# EAGLE design Starter Shield v1.1 (EAGLE 6.4)
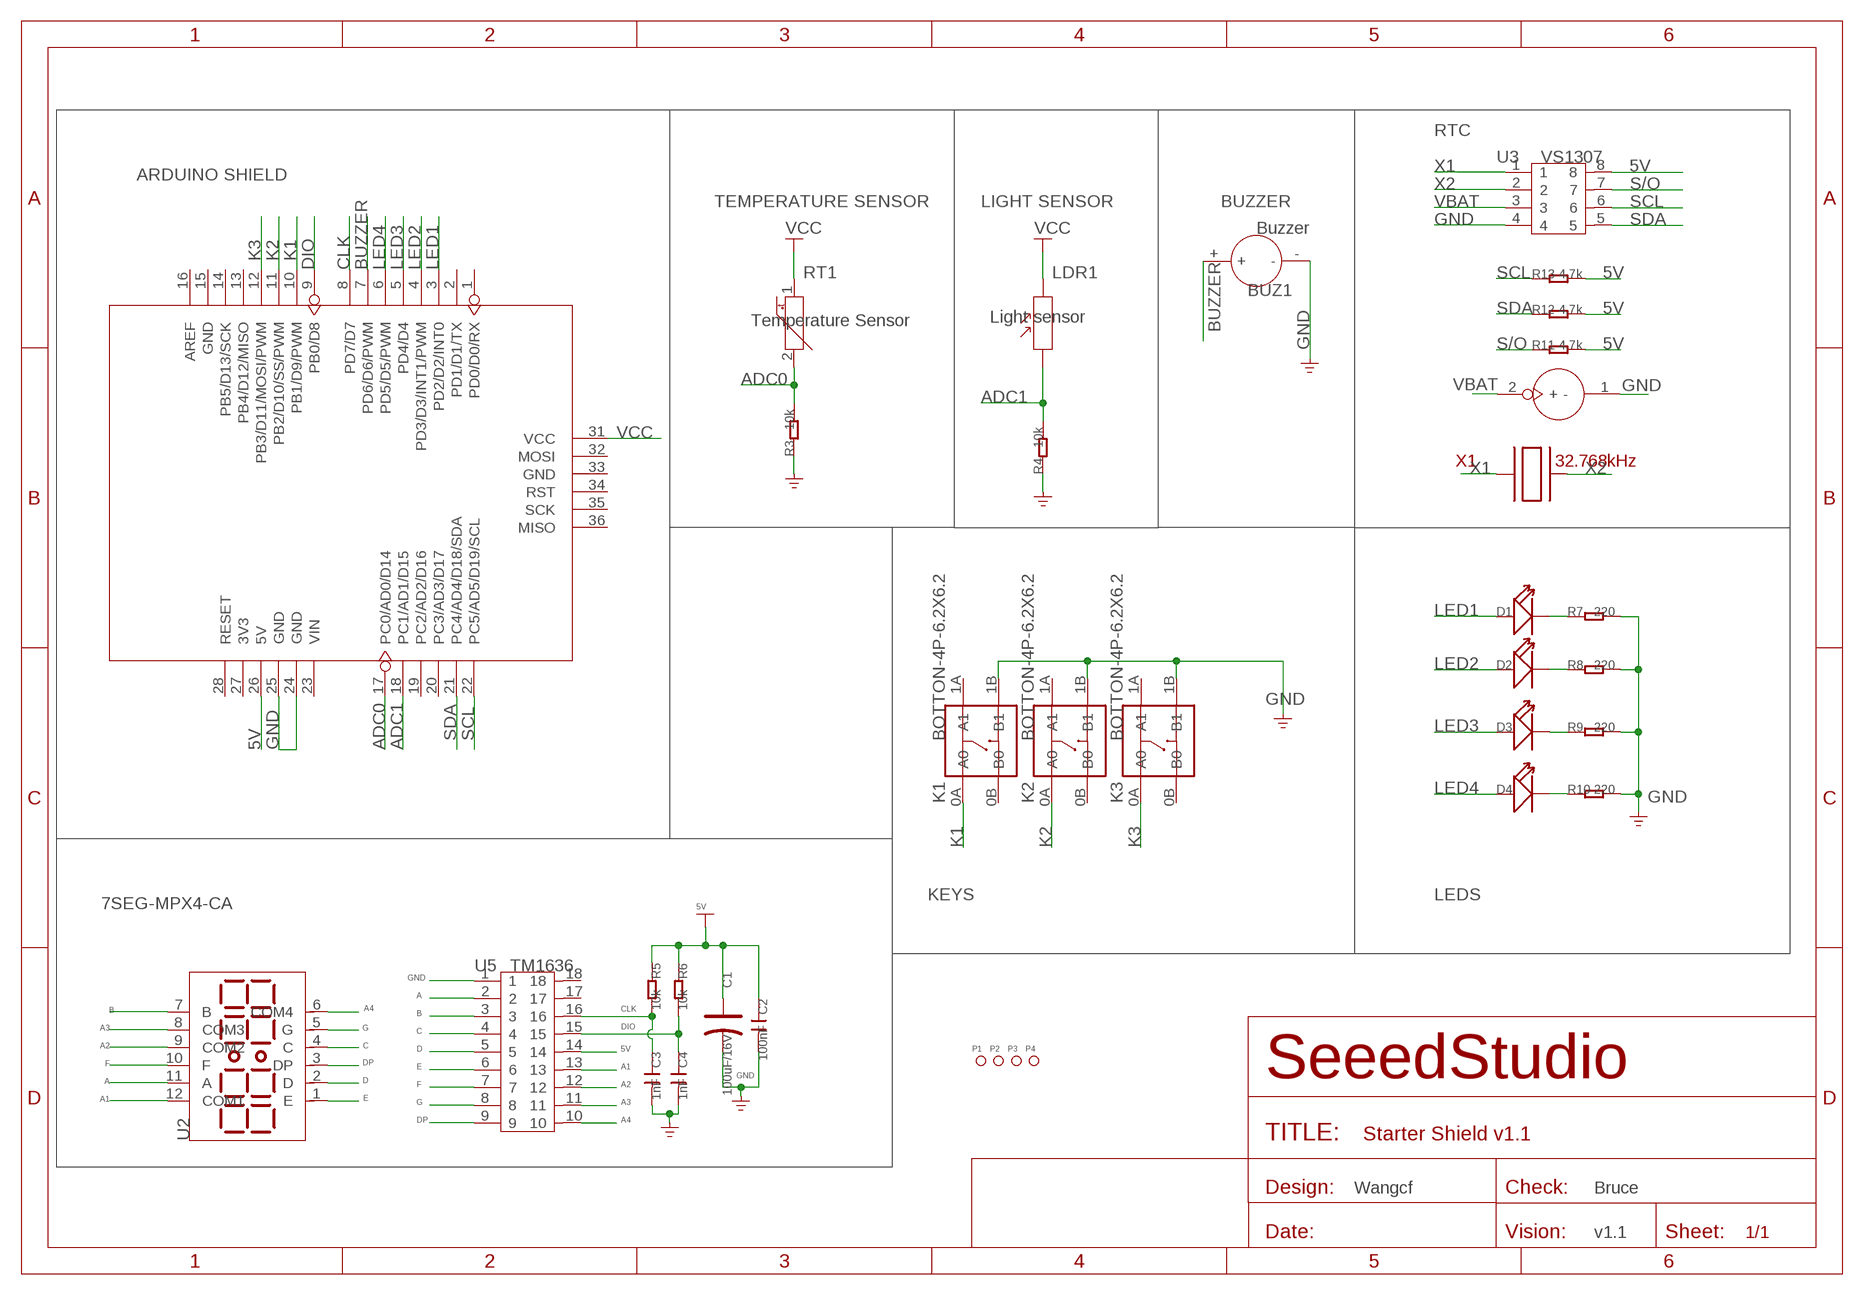
[diagram p0: schematic, sheet 1]

## Parts
BATT1  BATTERYBATTERY1225_SMT  [BATTERY1225_SMT]
BUZ1  Buzzer  BUZZER-YMD12065  [2P-7.6-D12X6.5H]
C1  100uF/16V  CAP-D5.3/2.0  [ELECTRO-5.3MM]
C2  100nF  C'2.54'  [CERAMIC-2.54]
C3  1nF  C'2.54'  [CERAMIC-2.54]
C4  1nF  C'2.54'  [CERAMIC-2.54]
D1  LED-3MM  [LED-2P-2.54-3MM]
D2  LED-3MM  [LED-2P-2.54-3MM]
D3  LED-3MM  [LED-2P-2.54-3MM]
D4  LED-3MM  [LED-2P-2.54-3MM]
K1  BOTTON-4P-6.2X6.2  BOTTON-4P-8X8  [4P-8X8]
K2  BOTTON-4P-6.2X6.2  BOTTON-4P-8X8  [4P-8X8]
K3  BOTTON-4P-6.2X6.2  BOTTON-4P-8X8  [4P-8X8]
LDR1  Light sensor  R-PHOTOVARISTOR  [5528]
P1  PAD-MARK  [ROUND-MARK-1.0]
P2  PAD-MARK  [ROUND-MARK-1.0]
P3  PAD-MARK  [ROUND-MARK-1.0]
P4  PAD-MARK  [ROUND-MARK-1.0]
R3  10k  R-0207/7  [R0207/7]
R4  10k  R-0207/7  [R0207/7]
R5  10k  R-0207/7  [R0207/7]
R6  10k  R-0207/7  [R0207/7]
R7  220  R-0207/7  [R0207/7]
R8  220  R-0207/7  [R0207/7]
R9  220  R-0207/7  [R0207/7]
R10  220  R-0207/7  [R0207/7]
R11  4.7k  R-0207/7  [R0207/7]
R12  4.7k  R-0207/7  [R0207/7]
R13  4.7k  R-0207/7  [R0207/7]
RT1  Temperature Sensor  R-THERMISTOR'TTC3A103"39H"'  [2P-2.54-D3.0MM]
U1  ARDUINO'W/-SILK  [ARDUINO]
U2  LED-4-BIT-7-SEG'SR430563K'  [7-4-BIT-SEG-2.54-50X19X8H]
U3  VS1307  HOLDER-IC-8P  [DIP8]
U5  TM1636  HODER-IC-SOCKET-18P  [DIP18]
X1  32.768kHz  XTL_S  [XTL_S]

## Nets
5V: C1.+ C2.1 R5.1 R6.1 R11.2 R12.2 R13.2 U1.26(5V) U3.8 U5.14
A: U2.11(A) U5.2
A1: U2.12(COM1) U5.13
A2: U2.9(COM2) U5.12
A3: U2.8(COM3) U5.11
A4: U2.6(COM4) U5.10
ADC0: R3.2 RT1.2 U1.17(PC0/AD0/D14)
ADC1: LDR1.1 R4.2 U1.18(PC1/AD1/D15)
B: U2.7(B) U5.3
BUZZER: BUZ1.+ U1.7(PD6/D6/PWM)
C: U2.4(C) U5.4
CLK: C3.1 R5.2 U1.8(PD7/D7) U5.16
D: U2.2(D) U5.5
DIO: C4.1 R6.2 U1.9(PB0/D8) U5.15
DP: U2.3(DP) U5.9
E: U2.1(E) U5.6
F: U2.10(F) U5.7
G: U2.5(G) U5.8
GND: BATT1.1(-) BUZ1.- C1.- C2.2 C3.2 C4.2 K1.1B(B1) K2.1B(B1) K3.1B(B1) R3.1 R4.1 R7.2 R8.2 R9.2 R10.2 U1.24(GND) U1.25(GND) U3.4 U5.1
K1: K1.0A(A0) U1.10(PB1/D9/PWM)
K2: K2.0A(A0) U1.11(PB2/D10/SS/PWM)
K3: K3.0A(A0) U1.12(PB3/D11/MOSI/PWM)
LED1: D1.A(+) U1.3(PD2/D2/INT0)
LED2: D2.A(+) U1.4(PD3/D3/INT1/PWM)
LED3: D3.A(+) U1.5(PD4/D4)
LED4: D4.A(+) U1.6(PD5/D5/PWM)
N$5: D1.K(-) R7.1
N$6: D2.K(-) R8.1
N$7: D3.K(-) R9.1
N$8: D4.K(-) R10.1
S/O: R11.1 U3.7
SCL: R13.1 U1.22(PC5/AD5/D19/SCL) U3.6
SDA: R12.1 U1.21(PC4/AD4/D18/SDA) U3.5
VBAT: BATT1.2(+) U3.3
VCC: LDR1.2 RT1.1 U1.31(VCC)
X1: U3.1 X1.1
X2: U3.2 X1.2
Unconnected: K1.0B(B0) K1.1A(A1) K2.0B(B0) K2.1A(A1) K3.0B(B0) K3.1A(A1) U1.1(PD0/D0/RX) U1.2(PD1/D1/TX) U1.13(PB4/D12/MISO) U1.14(PB5/D13/SCK) U1.15(GND) U1.16(AREF) U1.19(PC2/AD2/D16) U1.20(PC3/AD3/D17) U1.23(VIN) U1.27(3V3) U1.28(RESET) U1.32(MOSI) U1.33(GND) U1.34(RST) U1.35(SCK) U1.36(MISO) U5.17 U5.18

## Notes on the sheet
- RTC
- ARDUINO SHIELD
- TEMPERATURE SENSOR | LIGHT SENSOR | BUZZER
- KEYS | LEDS
- 7SEG-MPX4-CA
- Wangcf | Bruce
- v1.1

## Library data of the parts
BATT1 = seeedleo:BATTERY
BUZ1 = template:BUZZER-YMD12065
C1 = Discrete:CAP*: Electrolytic Capacitors,Tantalum Capacitors and Super Capacitors
C2-C4 = Discrete:C*: Ceramic Capacitors
D1-D4 = Discrete:LED*
K1-K3 = Discrete:BOTTON-4P
LDR1 = Discrete:R-PHOTOVARISTOR: Photovaristor
P1-P4 = Discrete:PAD-MARK; PARTNO: DNP
R3-R13 = Discrete:R*
RT1 = Discrete:R-THERMISTOR
U1 = moudle:ARDUINO
U2 = moudle:LED-4-BIT-7-SEG
U3 = template:HOLDER-IC-8P
U5 = template:HODER-IC-SOCKET-18P
X1 = template:XTL_S

## Board
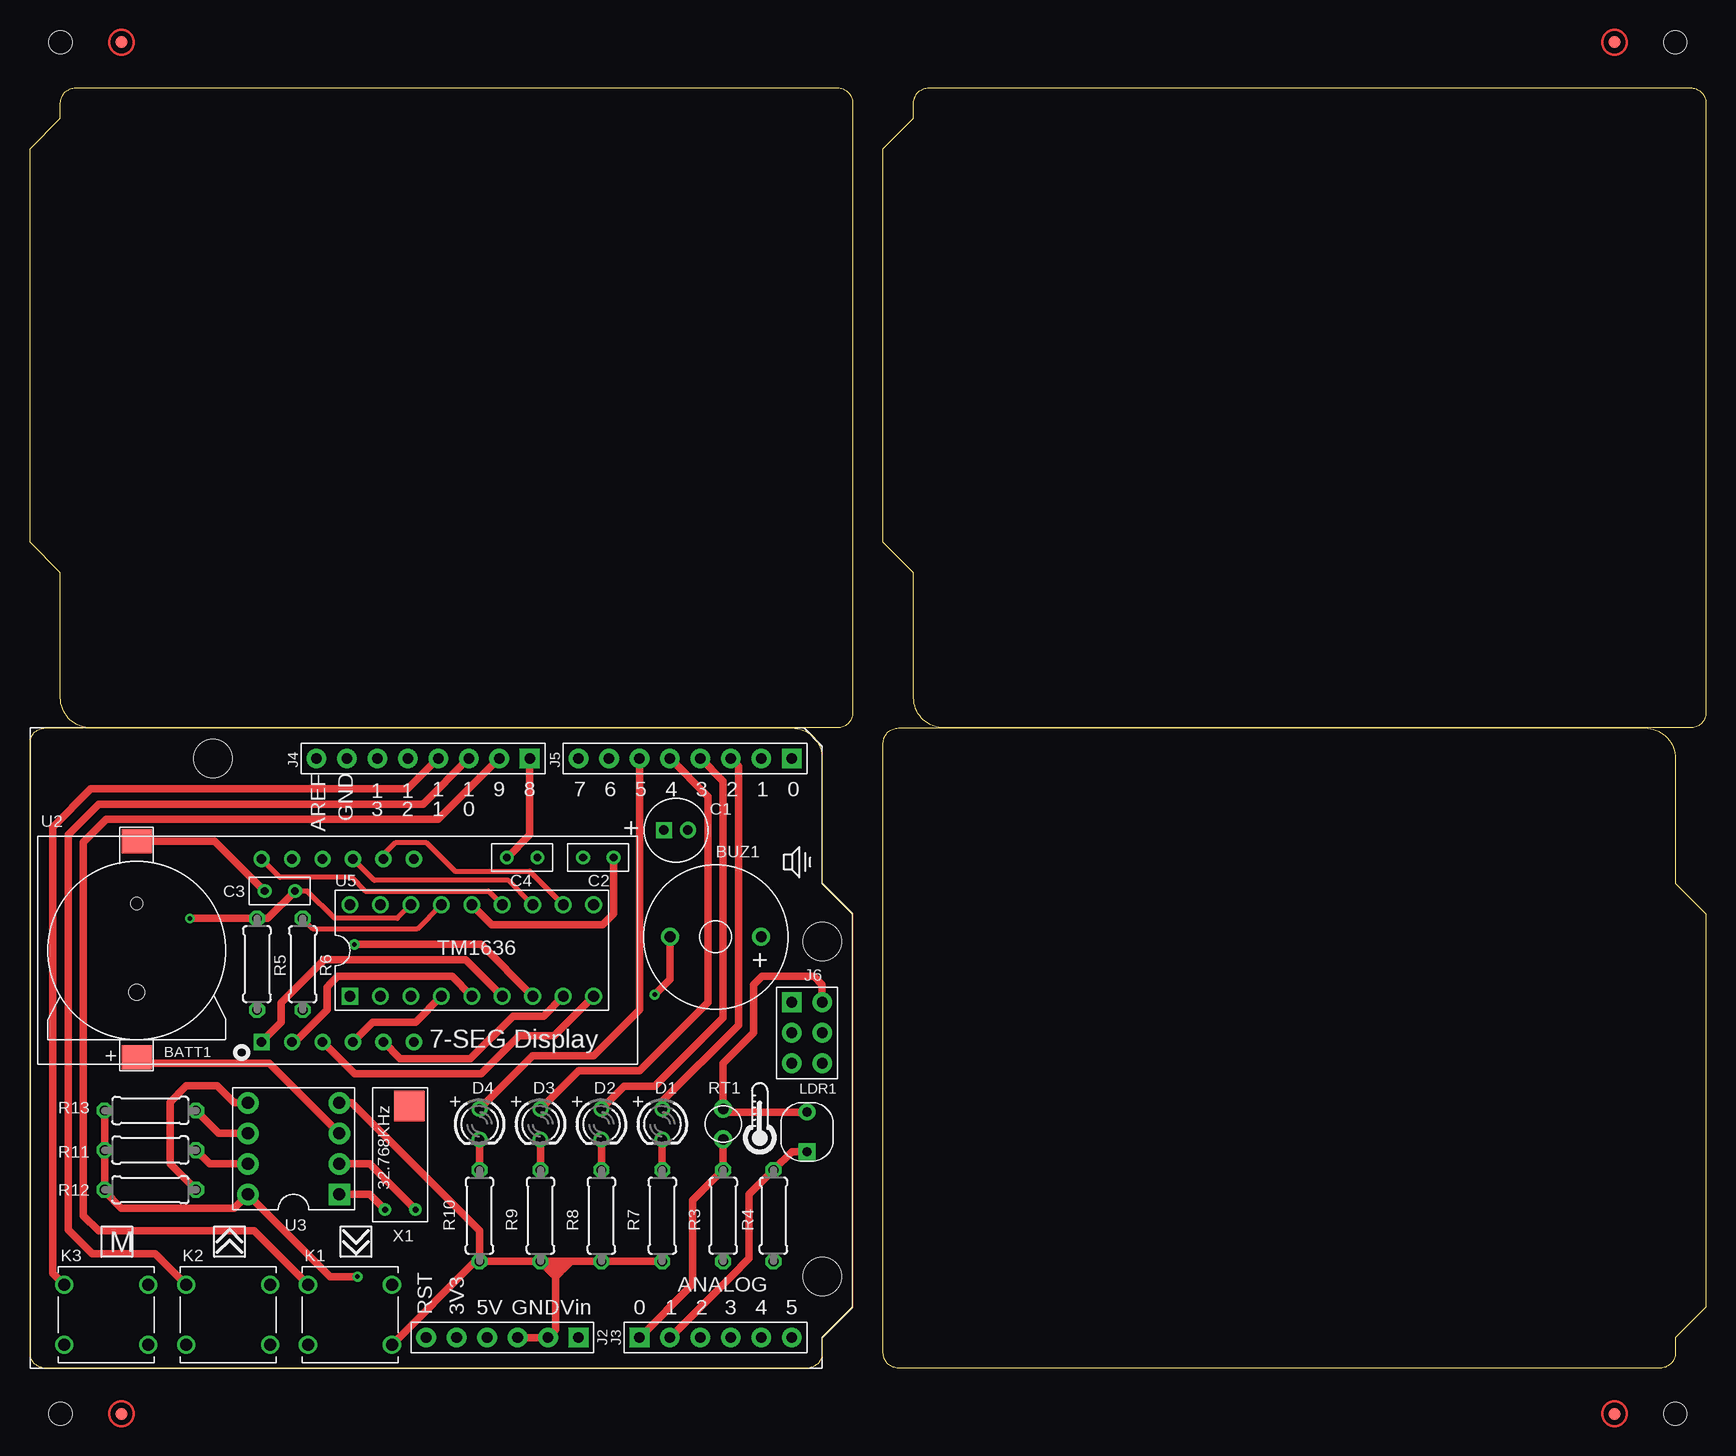
[diagram p1: board, top side]
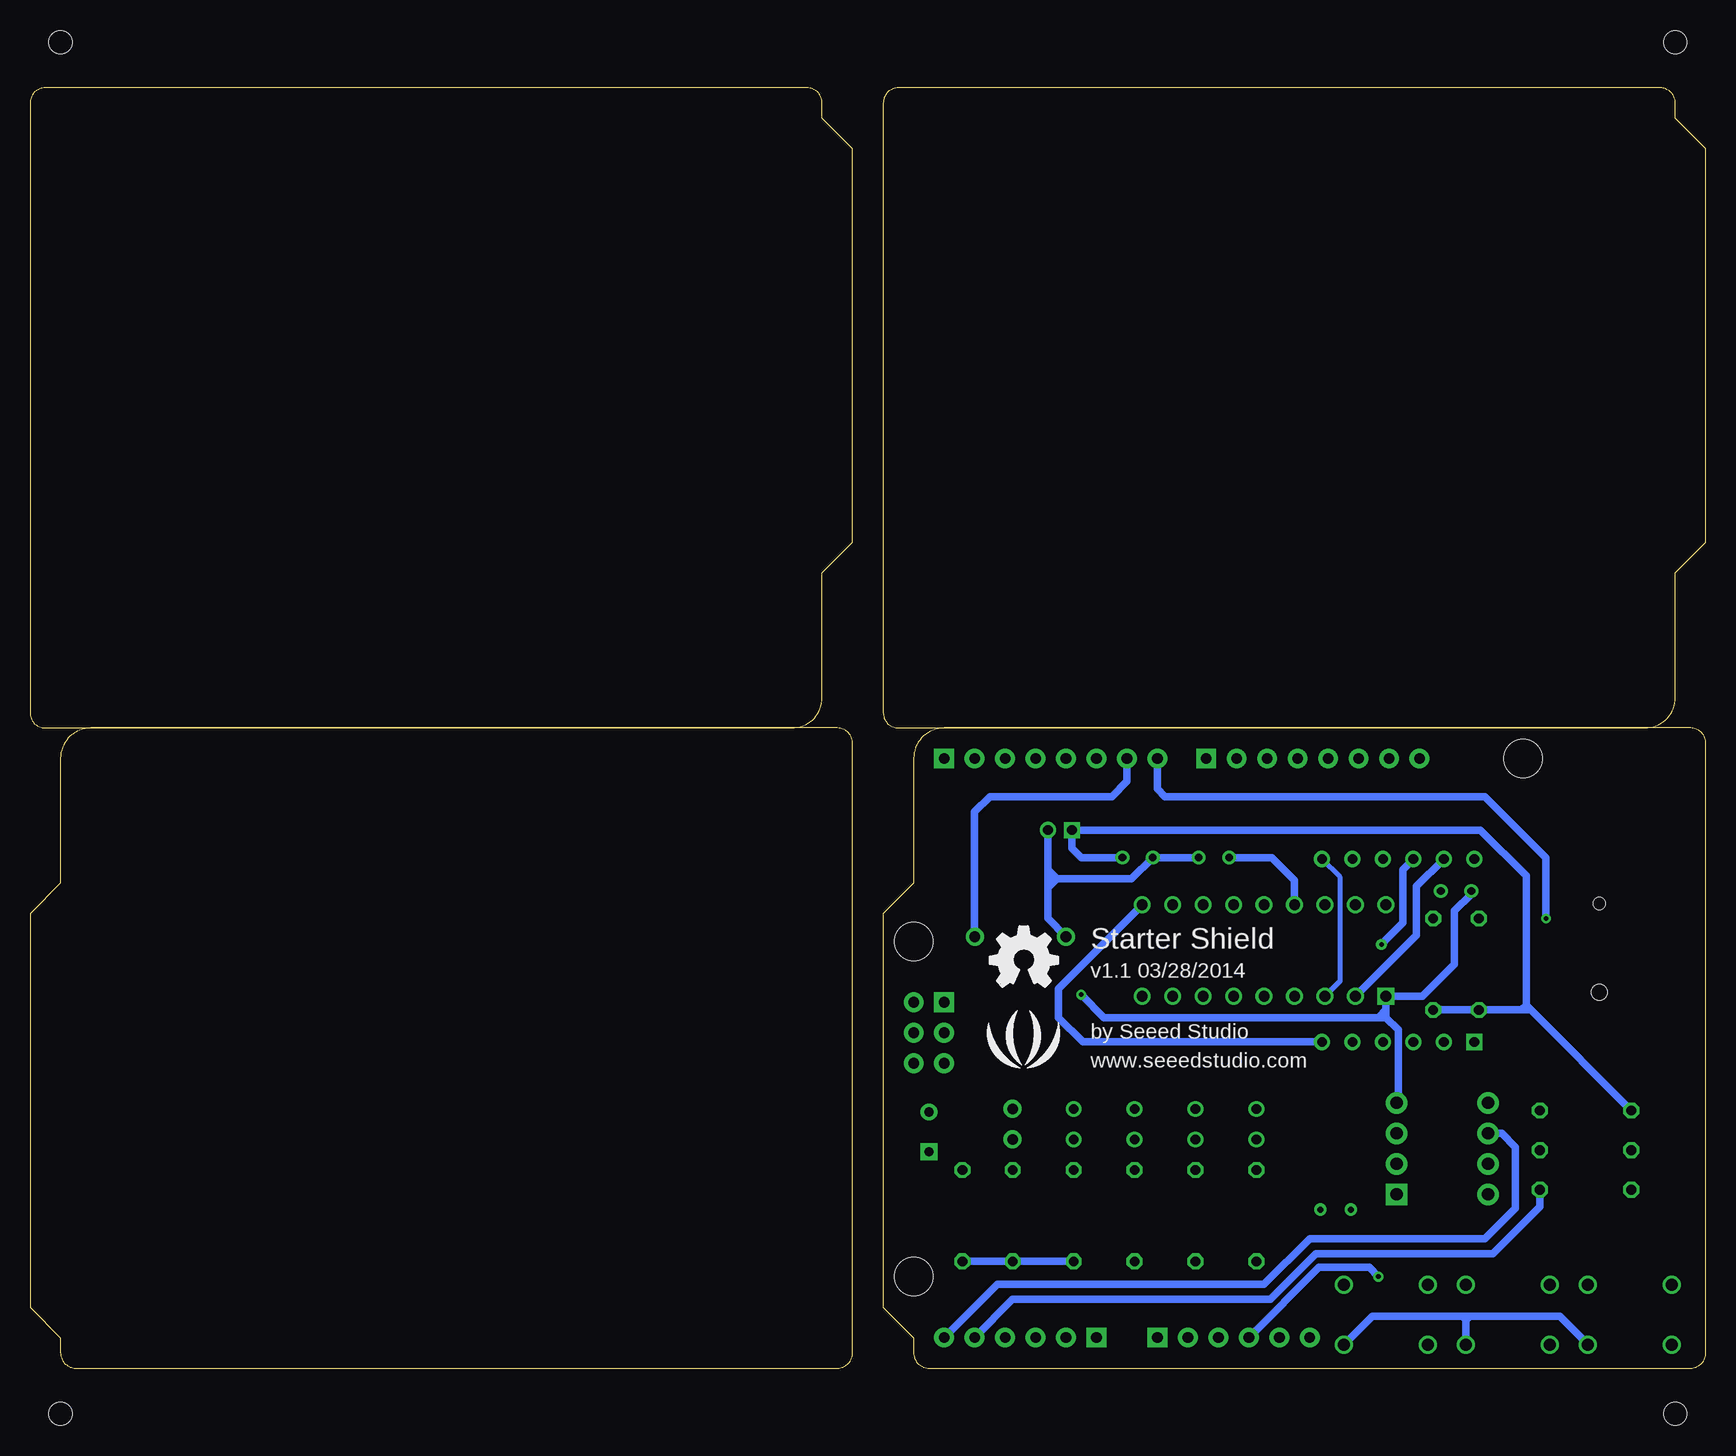
[diagram p2: board, bottom side, seen from below]

Size 139.7 x 106.68 mm. Coordinates in mm from the lower left corner, seen from the top.
Outline: 66.04,2.54 66.04,1.27 arc-90 64.77,0 1.27,0 arc-90 0,1.27 0,52.07 arc-90 1.27,53.34 63.5,53.34 arc-90 66.04,50.8 66.04,40.39 68.58,37.85 68.58,5.08 66.04,2.54
Outline: 137.16,2.54 137.16,1.27 arc-90 135.89,0 72.39,0 arc-90 71.12,1.27 71.12,52.07 arc-90 72.39,53.34 134.62,53.34 arc-90 137.16,50.8 137.16,40.39 139.7,37.85 139.7,5.08 137.16,2.54
Outline: 73.66,104.14 73.66,105.41 arc-90 74.93,106.68 138.43,106.68 arc-90 139.7,105.41 139.7,54.61 arc-90 138.43,53.34 76.2,53.34 arc-90 73.66,55.88 73.66,66.29 71.12,68.83 71.12,101.6 73.66,104.14
Outline: 2.54,104.14 2.54,105.41 arc-90 3.81,106.68 67.31,106.68 arc-90 68.58,105.41 68.58,54.61 arc-90 67.31,53.34 5.08,53.34 arc-90 2.54,55.88 2.54,66.29 0,68.83 0,101.6 2.54,104.14
Copper layers (1*16): Top 0.035mm / dielectric 1.5mm / Bottom 0.035mm
Design rules "default": minimum track width 6mil, minimum drill 12mil, track to track 8mil, track to pad 8mil, pad to pad 8mil, via to via 8mil, smd to smd 0mil, copper to edge 10mil, drill to drill 10mil, minimum pad ring 10mil, minimum via ring 6mil, stop-mask expansion 2mil, vias tented up to drill 100mil, thermal gap 10mil
Holes 1.91 mm at 2.54,-3.81 137.16,-3.81 137.16,110.49 2.54,110.49

### Footprints (pad centres in the part's own frame; a part is rotated, then mirrored left to right if it is on the bottom)
BATTERY1225_SMT = smd 2 x 2.5: 1 -9.119,0; 2 8.89,0 | hole 1: -3.913,0 | hole 1.3: 3.487,0
2P-7.6-D12X6.5H = drill 0.9 pad 1.5: + -3.8,0; - 3.8,0
ELECTRO-5.3MM = drill 0.8 pad 1.35 square: + -1,0 | drill 0.8 pad 1.35: - 1,0
CERAMIC-2.54 = drill 0.635 pad 1.143: 1 -1.27,0; 2 1.27,0
LED-2P-2.54-3MM = drill 0.813: A -1.27,0; K 1.27,0
4P-8X8 = drill 1: 0A -3.5,2.5; 0B 3.5,2.5; 1A -3.5,-2.5; 1B 3.5,-2.5
5528 = drill 0.762 pad 1.397 square: 1 -1.651,0 | drill 0.762 pad 1.397: 2 1.651,0
ROUND-MARK-1.0 = smd 1.016 x 1.016: P$1 0,0
R0207/7 = drill 0.813 octagon: 1 -3.81,0; 2 3.81,0
2P-2.54-D3.0MM = drill 0.9 pad 1.5: 1 -1.27,0; 2 1.27,0
ARDUINO = drill 0.889 pad 1.651 square: 1 63.5,50.8; 9 41.656,50.8; 17 50.8,2.54; 23 45.72,2.54; 36 63.5,30.48 | drill 0.889 pad 1.651: 2 60.96,50.8; 3 58.42,50.8; 4 55.88,50.8; 5 53.34,50.8; 6 50.8,50.8; 7 48.26,50.8; 8 45.72,50.8; 10 39.116,50.8; 11 36.576,50.8; 12 34.036,50.8; 13 31.496,50.8; 14 28.956,50.8; 15 26.416,50.8; 16 23.876,50.8; 18 53.34,2.54; 19 55.88,2.54; 20 58.42,2.54; 21 60.96,2.54; 22 63.5,2.54; 24 43.18,2.54; 25 40.64,2.54; 26 38.1,2.54; 27 35.56,2.54; 28 33.02,2.54; 31 66.04,30.48; 32 66.04,27.94; 33 66.04,25.4; 34 63.5,25.4; 35 63.5,27.94 | hole 3.2: 15.24,50.8; 66.04,35.56; 66.04,7.62
7-4-BIT-SEG-2.54-50X19X8H = drill 0.8 pad 1.35 square: 1 -6.35,-7.62 | drill 0.8 pad 1.35: 2 -3.81,-7.62; 3 -1.27,-7.62; 4 1.27,-7.62; 5 3.81,-7.62; 6 6.35,-7.62; 7 6.35,7.62; 8 3.81,7.62; 9 1.27,7.62; 10 -1.27,7.62; 11 -3.81,7.62; 12 -6.35,7.62
DIP8 = drill 1.016 pad 1.778 square: 1 -3.81,-3.81 | drill 1.016 pad 1.778: 2 -1.27,-3.81; 3 1.27,-3.81; 4 3.81,-3.81; 5 3.81,3.81; 6 1.27,3.81; 7 -1.27,3.81; 8 -3.81,3.81
DIP18 = drill 0.9 pad 1.4 square: 1 -10.16,-3.81 | drill 0.9 pad 1.4: 2 -7.62,-3.81; 3 -5.08,-3.81; 4 -2.54,-3.81; 5 0,-3.81; 6 2.54,-3.81; 7 5.08,-3.81; 8 7.62,-3.81; 9 10.16,-3.81; 10 10.16,3.81; 11 7.62,3.81; 12 5.08,3.81; 13 2.54,3.81; 14 0,3.81; 15 -2.54,3.81; 16 -5.08,3.81; 17 -7.62,3.81; 18 -10.16,3.81
XTL_S = drill 0.508: 1 0,0; 2 0,-2.54 | smd 2.54 x 2.54: 3 8.636,-2.032

### Placement (x,y rotation side)
BATT1  8.89,34.8 270 top
BUZ1  57.15,35.94 180 top
C1  53.85,44.83 0 top
C2  47.37,42.55 180 top
C3  20.83,39.75 180 top
C4  41.02,42.55 0 top
D1  52.7,20.32 270 top
D2  47.62,20.32 270 top
D3  42.55,20.32 270 top
D4  37.47,20.32 270 top
K1  26.67,4.45 0 top
K2  16.51,4.45 0 top
K3  6.35,4.45 0 top
LDR1  64.77,19.68 90 top
P1  7.62,-3.81 0 top  (outside the outline)
P2  132.08,-3.81 0 top  (outside the outline)
P3  132.08,110.49 0 top  (outside the outline)
P4  7.62,110.49 0 top  (outside the outline)
R3  57.78,12.7 90 top
R4  61.98,12.7 90 top
R5  18.92,33.66 90 top
R6  22.73,33.66 90 top
R7  52.7,12.7 270 top
R8  47.62,12.7 270 top
R9  42.55,12.7 270 top
R10  37.47,12.7 270 top
R11  10.03,18.16 180 top
R12  10.03,14.86 180 top
R13  10.03,21.46 180 top
RT1  57.78,20.32 270 top
U1  0,0 0 top
U2  25.65,34.8 0 top
U3  21.97,18.29 90 top
U5  36.83,34.8 0 top
U$11  [LOGO_SILK]  56.9,26.67 0 bottom
U$12  [OSHW_FILLX200_NOTEXT]  59.69,31.75 0 bottom
X1  29.59,13.21 90 top

### Tracks (layer width: path | path; a pad name or v marks a point on that pad's centre or on a via)
5V  (via drill 0.38 pad 0.81)
  Top 0.406: 38.35,37.08 U5.14
  Top 0.61: C2.1 48.64,37.85 47.75,36.96 38.48,36.96 U5.14 | R13.2 R11.2 R12.2 6.22,14.73 7.62,13.34 17.02,13.34 U3.8 25.02,7.62 v27.3,7.62
  Bottom 0.61: 14.99,30.23 14.99,41.02 18.8,44.83 C1.+ 52.85,43.32 52.07,42.55 C2.1 | 14.99,30.23 14.99,30.1 | 15.37,29.84 R5.1 R6.1 | 15.37,29.84 15.24,29.84 | 15.24,29.84 14.61,29.84 | 14.61,29.84 R13.2 | 14.99,30.1 15.24,29.84 | 14.99,30.1 14.86,30.1 14.61,29.84 | 14.99,30.23 15.37,29.84 | v27.3,7.62 28.07,8.38 32.26,8.38 U1.26
A
  Bottom 0.61: U2.11 24.13,40.13 24.13,36.07 U5.2
A1
  Top 0.406: U2.12 20.83,40.89 26.8,40.89 27.94,39.75 38.23,39.75 U5.13
A2
  Top 0.406: U5.12 39.88,40.64 28.7,40.64 U2.9
A3
  Top 0.406: U2.8 29.46,42.8 30.48,43.81 33.02,43.81 35.43,41.4 41.66,41.4 U5.11
A4
  Bottom 0.61: U2.6 51.94,27.18 53.98,29.21 53.98,31.62 U5.10
ADC0
  Top 0.61: RT1.2 R3.2 55.24,13.97 55.24,6.99 U1.17
ADC1
  Top 0.61: LDR1.1 63.5,18.03 R4.2 59.94,14.48 59.94,9.14 58.42,7.62 U1.18
B
  Bottom 0.406: U5.3 30.48,32.26 30.48,40.89 U2.7
BUZZER
  Bottom 0.61: U1.7 48.26,48.9 49.53,47.62 59.69,47.62 60.96,46.35 60.96,35.95 BUZ1.+
C
  Top 0.61: U2.4 28.57,28.83 32.13,28.83 U5.4
CLK  (via drill 0.38 pad 0.81)
  Top 0.406: U5.16 30.61,37.47 25.4,37.47 23.11,39.75 C3.1
  Top 0.61: C3.1 19.81,37.47 R5.2 v13.34,37.47
  Bottom 0.61: U1.8 45.72,48.26 45.09,47.62 18.41,47.62 13.34,42.55 v13.34,37.47
D
  Top 0.61: U5.5 35.18,32.64 25.65,32.64 25.4,32.38 25.08,32.07 24.77,31.75 24.77,29.84 22.1,27.18 U2.2
DIO
  Top 0.406: U5.15 32.26,36.58 23.62,36.58 R6.2
  Top 0.61: U1.9 41.66,44.45 C4.1
  Bottom 0.61: C4.1 36.2,42.55 34.29,40.64 U5.15
DP
  Top 0.61: U5.9 43.69,27.69 40.77,27.69 37.59,24.51 27.05,24.51 U2.3
E
  Top 0.61: U5.6 36.32,34.04 24.53,34.04 20.95,30.46 20.95,28.83 U2.1
F  (via drill 0.38 pad 0.89)
  Top 0.61: v27.05,35.31 37.59,35.31 U5.7
  Bottom 0.61: U2.10 25.27,41.53 25.27,37.11 26.82,35.56 26.82,35.54 v27.05,35.31
G
  Top 0.61: U2.5 30.86,25.78 36.7,25.78 40.26,29.34 42.8,29.34 U5.8
GND  (via drill 0.38 pad 0.81)
  Top 0.61: U3.4 26.8,22.1 37.47,11.43 R10.2 | K1.1B 37.12,8.89 R10.2 | BATT1.1 15.39,43.92 C3.2 | U1.25 U1.24 43.81,3.17 43.81,7.62 | R10.2 R9.2 | R9.2 43.18,8.89 | 43.18,8.89 43.81,8.89 | 43.81,8.89 44.45,8.89 | 44.96,8.89 45.09,8.89 | v52.07,31.11 53.34,32.38 BUZ1.- | 43.81,7.62 43.18,8.26 | 43.18,8.26 R9.2 | 43.81,7.62 44.7,8.51 44.7,8.64 44.96,8.89 | 44.96,8.89 44.45,8.89 | 44.45,8.89 43.81,8.26 | 43.81,8.26 43.18,8.26 | 43.18,8.26 43.18,8.89 | 43.18,8.89 43.81,8.26 | 43.81,8.89 43.81,8.26 | 43.81,8.26 44.45,8.26 45.09,8.89 | 45.09,8.89 R8.2 R7.2
  Bottom 0.61: K3.1B 9.85,1.98 12.19,4.32 19.68,4.32 | 19.68,4.32 20.32,4.32 | 20.32,4.32 27.8,4.32 K1.1B | K2.1B 20.01,3.99 | 20.01,3.99 19.68,4.32 | C4.2 C2.2 47.88,40.77 54.1,40.77 | R4.1 R3.1 R7.2 | C3.2 19.56,39.5 20.95,38.1 20.95,33.66 23.62,30.99 U5.1 26.67,29.84 | 20.01,3.99 20.01,4.01 20.32,4.32 | 54.85,41.51 54.1,40.77 | BUZ1.- 53.35,35.95 54.86,37.47 54.86,41.5 54.85,41.51 | 54.1,40.77 54.74,40.13 | 54.85,41.51 C1.- | 27.3,29.21 50.16,29.21 v52.07,31.11 | 27.3,29.21 26.67,29.84 | 27.3,29.21 26.67,29.21 | 26.67,29.84 26.67,29.21 | 26.67,29.21 25.65,28.19 25.65,22.23 U3.4
K1
  Top 0.61: U1.10 34.04,45.72 6.35,45.72 4.45,43.81 4.45,12.7 5.71,11.43 18.68,11.43 K1.0A
K2
  Top 0.61: U1.11 32.77,46.99 5.71,46.99 3.17,44.45 3.17,11.53 5.18,9.53 10.43,9.53 K2.0A
K3
  Top 0.61: U1.12 31.5,48.26 5.08,48.26 1.91,45.09 1.91,7.89 K3.0A
LED1
  Top 0.61: D1.A 52.7,22.23 59.05,28.57 59.05,50.16 U1.3
LED2
  Top 0.61: D2.A 49.53,23.5 52.07,23.5 57.78,29.21 57.78,48.9 U1.4
LED3
  Top 0.61: D3.A 45.72,24.77 50.8,24.77 56.52,30.48 56.52,47.62 U1.5
LED4
  Top 0.61: U1.6 50.8,29.84 46.99,26.04 42.04,26.04 41.91,26.04 D4.A
N$5
  Top 0.61: R7.1 D1.K
N$6
  Top 0.61: R8.1 D2.K
N$7
  Top 0.61: R9.1 D3.K
N$8
  Top 0.61: R10.1 D4.K
S/O
  Top 0.61: U3.7 14.99,17.02 R11.1
SCL
  Top 0.61: U3.6 15.75,19.56 R13.1
  Bottom 0.61: U1.22 59.05,6.99 37.47,6.99 36.83,6.99 33.02,10.79 18.41,10.79 15.88,13.34 15.88,18.41 17.02,19.56 U3.6
SDA
  Top 0.61: U3.5 17.02,22.1 15.61,23.51 13.03,23.51 11.68,22.17 11.68,17.02 R12.1
  Bottom 0.61: U1.21 57.78,5.71 36.83,5.71 36.32,5.71 32.51,9.53 17.78,9.53 13.84,13.46 R12.1
VBAT
  Top 0.61: BATT1.2 8.89,25.4 19.94,25.4 U3.3
VCC
  Top 0.61: U1.31 66.04,31.95 65.36,32.64 61.01,32.64 60.33,31.95 60.33,27.94 58.17,25.78 57.78,25.4 RT1.1 58.04,21.34 LDR1.2
X1
  Top 0.61: 29.72,13.21 X1.1 28.32,14.48 U3.1
X2
  Top 0.61: U3.2 28.32,17.02 X1.2

### Text on the board
tPlace: J4 | J5 | AREF | TM1636 | J6 | 7-SEG Display | + | + | + | + | 32.768KHz | M | J2 | J3
bPlace: Starter Shield | v1.1 03/28/2014 | by Seeed Studio | www.seeedstudio.com